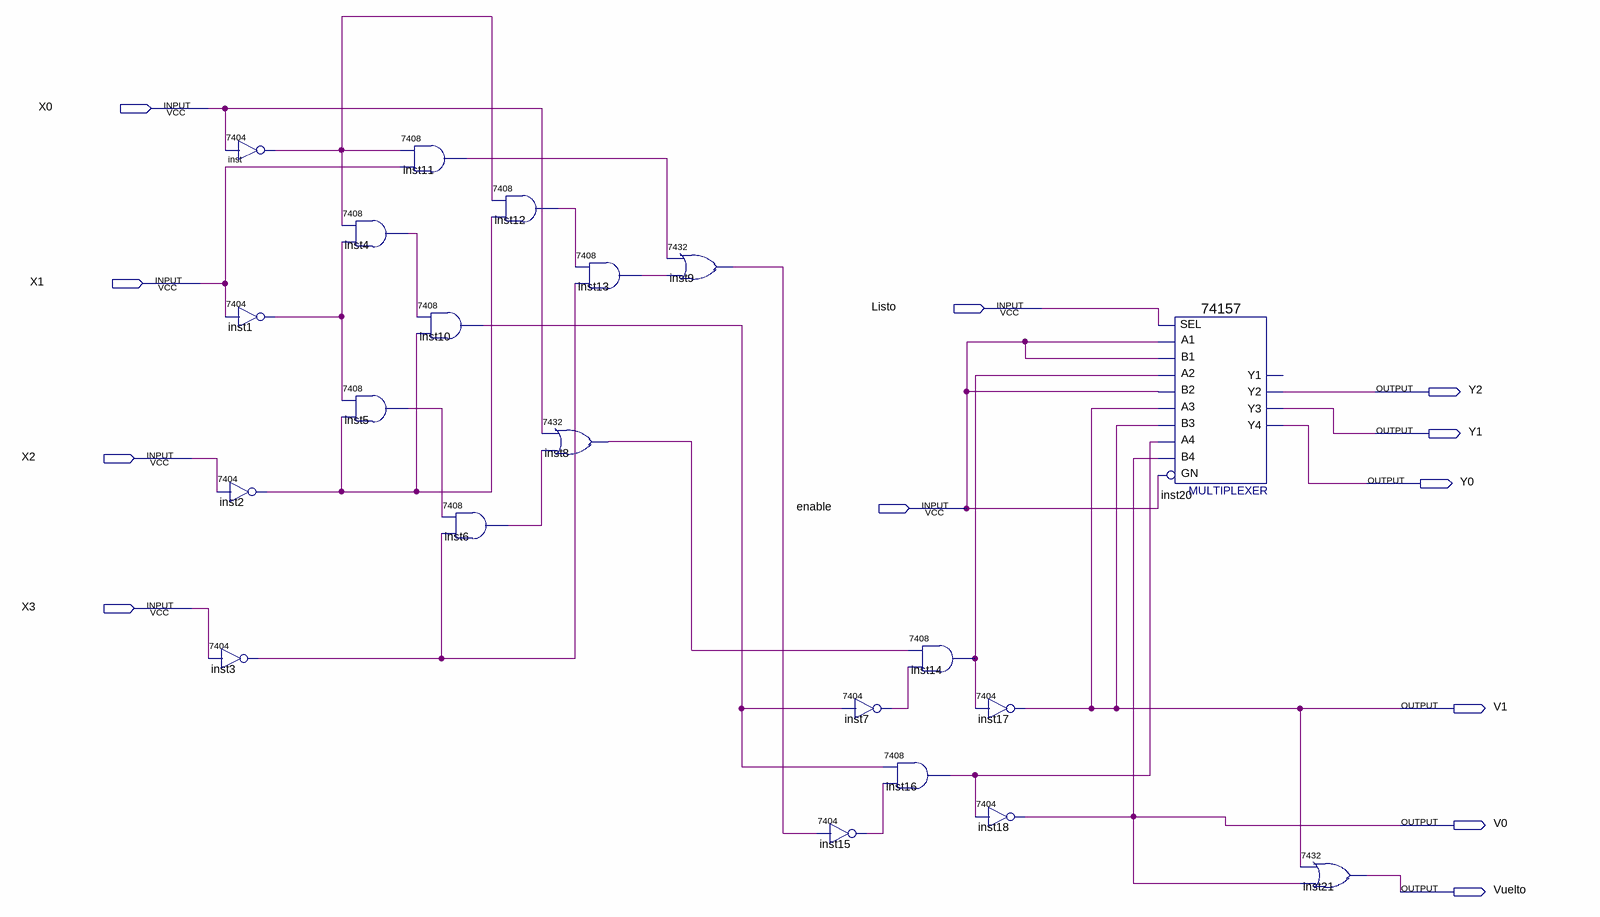
[diagram p0: schematic sheet]
// Quartus schematic Bloque.bdf as structural Verilog: 21 symbols, 12 pins
module Bloque (
  input  X0,
  input  X1,
  input  Listo,
  input  X2,
  input  enable,
  input  X3,
  output Y2,
  output Y1,
  output Y0,
  output V1,
  output V0,
  output Vuelto
);

  wire inst1_1, inst2_1, inst3_1, inst4_1, inst5_1, inst6_1, inst7_1, inst8_1, inst9_1, inst10_1, inst11_1,
       inst12_1, inst13_1, inst14_1, inst15_1, inst16_1, inst_1;

  \7404  inst (.\2 (X0), .\1 (inst_1));
  \7404  inst1 (.\2 (X1), .\1 (inst1_1));
  \7404  inst2 (.\2 (X2), .\1 (inst2_1));
  \7404  inst3 (.\2 (X3), .\1 (inst3_1));
  \7408  inst4 (.\3 (inst1_1), .\2 (inst_1), .\1 (inst4_1));
  \7408  inst5 (.\3 (inst2_1), .\2 (inst1_1), .\1 (inst5_1));
  \7408  inst11 (.\3 (X1), .\2 (inst_1), .\1 (inst11_1));
  \7408  inst10 (.\3 (inst2_1), .\2 (inst4_1), .\1 (inst10_1));
  \7408  inst12 (.\3 (inst2_1), .\2 (inst_1), .\1 (inst12_1));
  \7408  inst6 (.\3 (inst3_1), .\2 (inst5_1), .\1 (inst6_1));
  \7432  inst8 (.\2 (X0), .\3 (inst6_1), .\1 (inst8_1));
  \7408  inst13 (.\3 (inst3_1), .\2 (inst12_1), .\1 (inst13_1));
  \7432  inst9 (.\2 (inst11_1), .\3 (inst13_1), .\1 (inst9_1));
  \7404  inst15 (.\2 (inst9_1), .\1 (inst15_1));
  \7404  inst7 (.\2 (inst10_1), .\1 (inst7_1));
  \7408  inst16 (.\3 (inst15_1), .\2 (inst10_1), .\1 (inst16_1));
  \7408  inst14 (.\3 (inst7_1), .\2 (inst8_1), .\1 (inst14_1));
  \7404  inst17 (.\2 (inst14_1), .\1 (V1));
  \7404  inst18 (.\2 (inst16_1), .\1 (V0));
  \74157  inst20 (
    .A1(enable), .B1(enable), .SEL(Listo), .B2(enable), .A3(V1), .B3(V1), .A2(inst14_1), .B4(V0),
    .GN(enable), .A4(inst16_1), .Y2(Y2), .Y4(Y0), .Y3(Y1));  // open: Y1
  \7432  inst21 (.\2 (V1), .\3 (V0), .\1 (Vuelto));
endmodule
